# Altium schematic sheet GTY_Transceivers.SchDoc: RFSOC_AMC
size A2; Author: G.Kasprowicz; CompanyName: WUT ISE; DrawnBy: G.Kasprowicz; Organization: WUT ISE; Address1: PW ISE; Address2: Nowowiejska 15/19 00-665 Warsaw; Address3: gkasprow@gmail.com; DocumentNumber: 14; Revision: 2; SheetNumber: 15; SheetTotal: 54; ModifiedBy: -; CheckedDate: -; Title2: 8 channel ADC & DAC; DivGrp: WUT ISE; Designer: G.Kasprowicz; ModifiedDate: -; ProjectName: Sensor Box
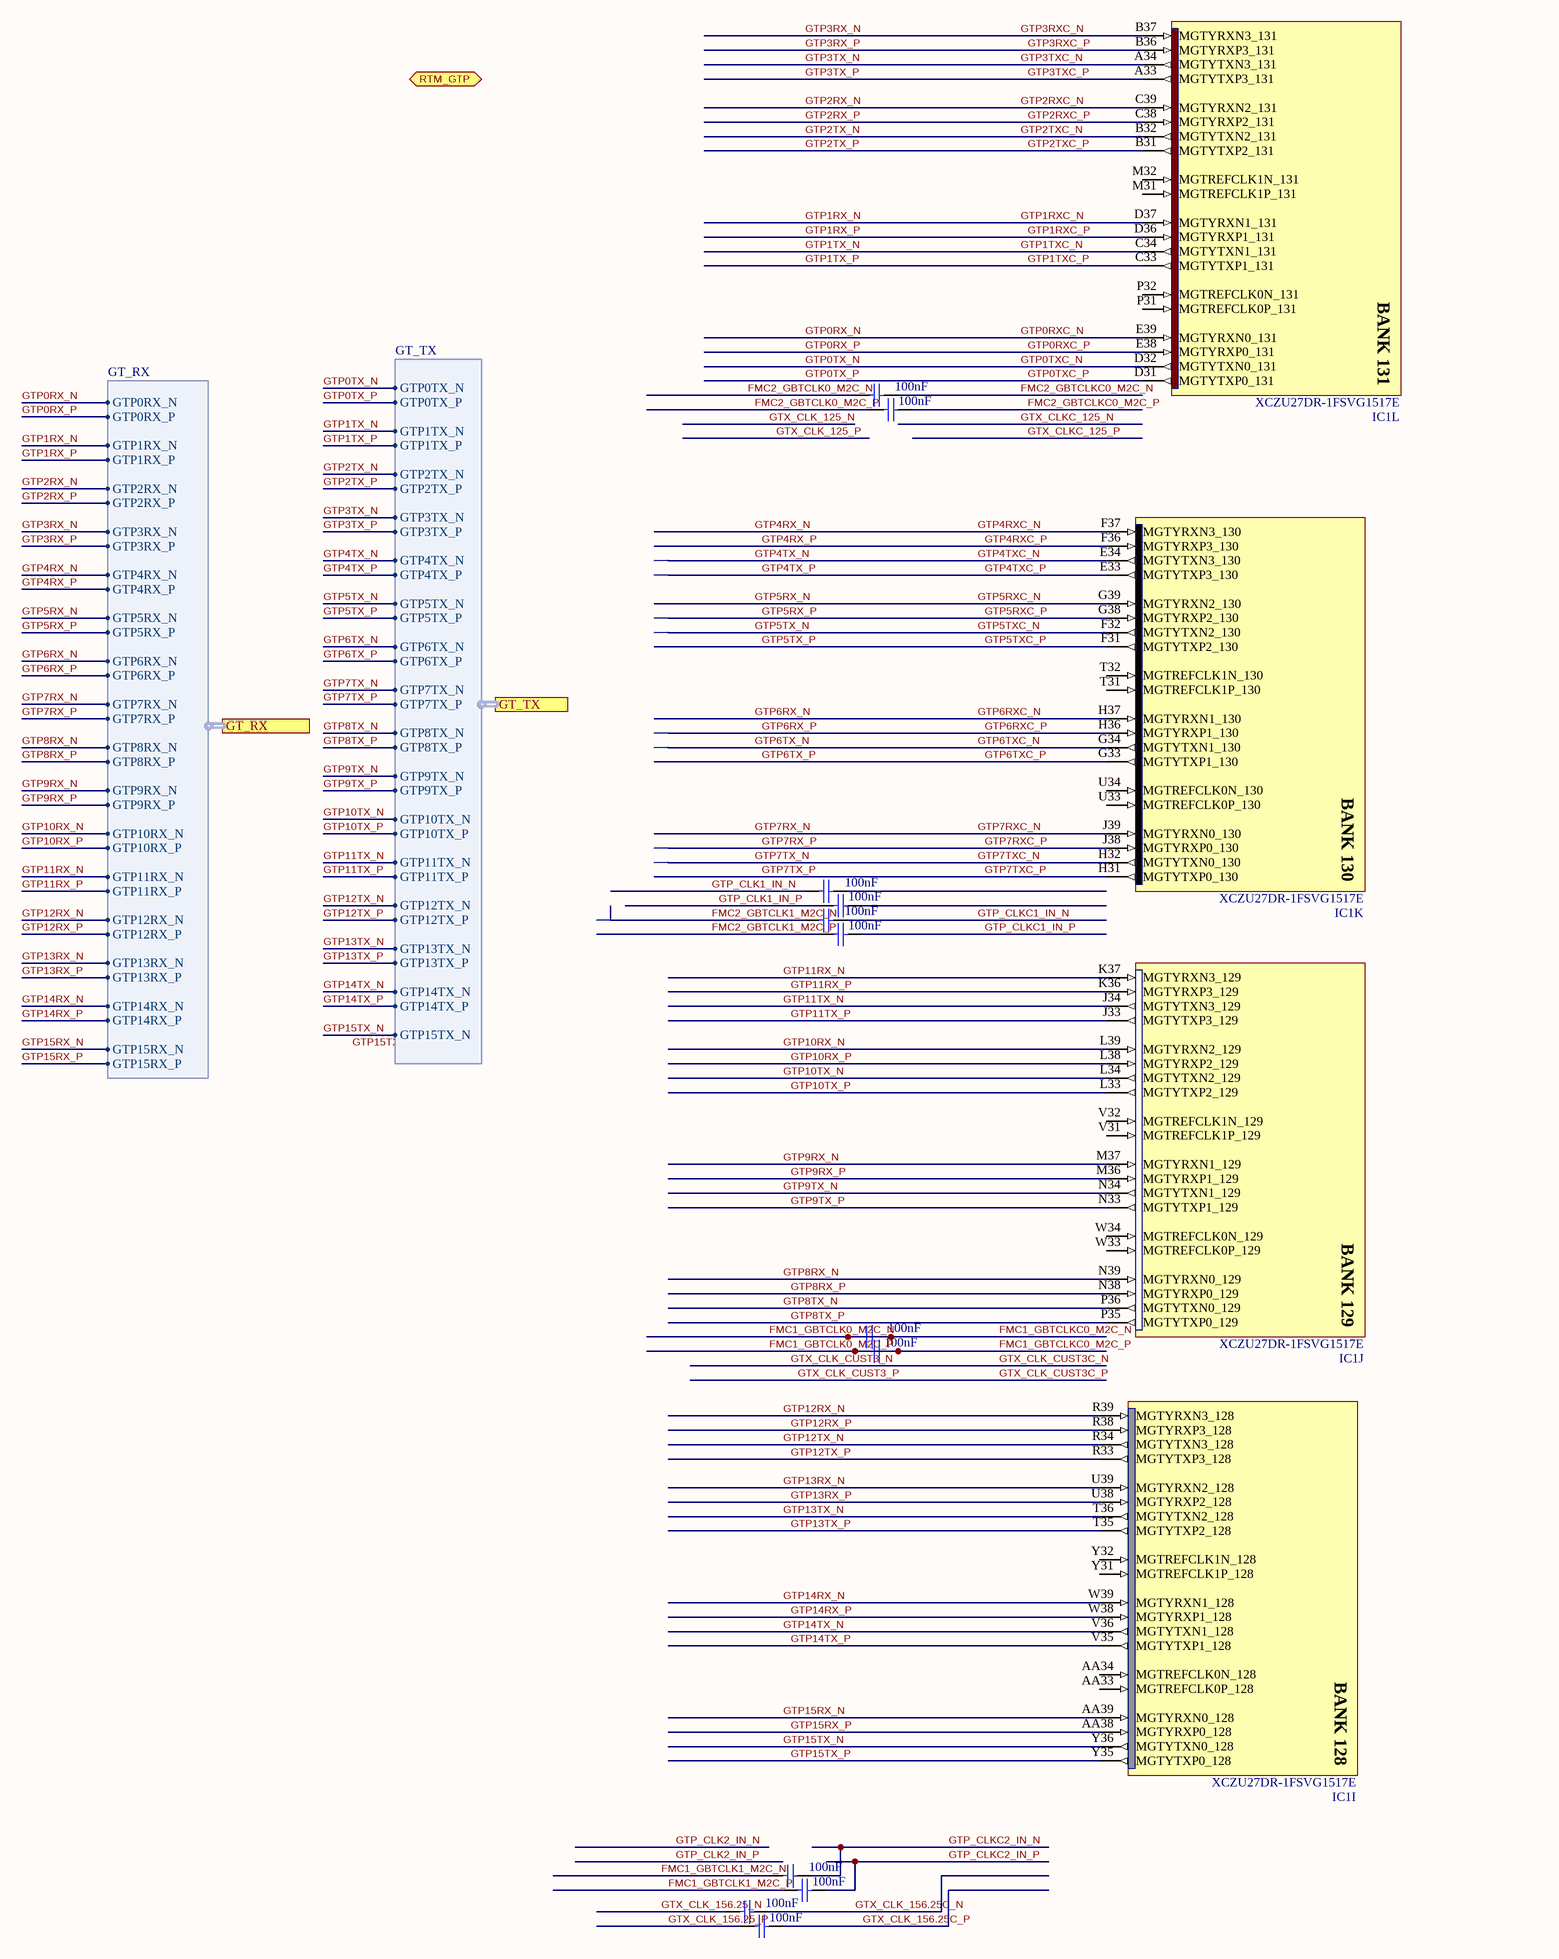
[diagram p0: GTY_Transceivers.SchDoc]

## Parts
C435  100nF
C436  100nF
C595  100nF
C596  100nF
C623  100nF
C624  100nF
C625  100nF
C626  100nF
C643  100nF
C644  100nF
C665  100nF
C666  100nF
IC1  XCZU27DR-1FSVG1517E  [XILINX_FSVG1517 (XCZU27DR)]  (parts I,J,K,L of 31)

## Ports
GT_RX (harness GT_RX), GT_TX (harness GT_TX), RTM_GTP (bidir)

## Harnesses
GT_RX: GTP0RX_N, GTP0RX_P, GTP1RX_N, GTP1RX_P, GTP2RX_N, GTP2RX_P, GTP3RX_N, GTP3RX_P, GTP4RX_P, GTP5RX_N, GTP4RX_N, GTP5RX_P, GTP6RX_N, GTP6RX_P, GTP7RX_N, GTP7RX_P, GTP8RX_N, GTP8RX_P, GTP9RX_N, GTP9RX_P, GTP10RX_N, GTP10RX_P, GTP11RX_N, GTP11RX_P, GTP12RX_N, GTP12RX_P, GTP13RX_N, GTP13RX_P, GTP14RX_N, GTP14RX_P, GTP15RX_N, GTP15RX_P
GT_TX: GTP0TX_N, GTP0TX_P, GTP1TX_N, GTP1TX_P, GTP2TX_N, GTP2TX_P, GTP3TX_N, GTP3TX_P, GTP4TX_N, GTP4TX_P, GTP5TX_N, GTP5TX_P, GTP6TX_N, GTP6TX_P, GTP7TX_N, GTP7TX_P, GTP8TX_N, GTP8TX_P, GTP9TX_N, GTP9TX_P, GTP10TX_N, GTP10TX_P, GTP11TX_N, GTP11TX_P, GTP12TX_N, GTP12TX_P, GTP13TX_N, GTP13TX_P, GTP14TX_N, GTP14TX_P, GTP15TX_N

## Nets
FMC1_GBTCLK0_M2C_N: C643.1 C643.2  [also labelled FMC1_GBTCLKC0_M2C_N]
FMC1_GBTCLK0_M2C_P: C644.1 C644.2  [also labelled FMC1_GBTCLKC0_M2C_P]
FMC1_GBTCLK1_M2C_N: C665.1
FMC1_GBTCLK1_M2C_P: C666.1
FMC2_GBTCLK0_M2C_N: C595.1
FMC2_GBTCLK0_M2C_P: C596.1
FMC2_GBTCLK1_M2C_N: C625.1
FMC2_GBTCLK1_M2C_P: C626.1
FMC2_GBTCLKC0_M2C_N: C595.2
FMC2_GBTCLKC0_M2C_P: C596.2
GTP0RX_N: IC1.E39(MGTYRXN0_131) ; port GT_RX.GTP0RX_N  [also labelled GTP0RXC_N]
GTP0RX_P: IC1.E38(MGTYRXP0_131) ; port GT_RX.GTP0RX_P  [also labelled GTP0RXC_P]
GTP0TX_N: IC1.D32(MGTYTXN0_131) ; port GT_TX.GTP0TX_N  [also labelled GTP0TXC_N]
GTP0TX_P: IC1.D31(MGTYTXP0_131) ; port GT_TX.GTP0TX_P  [also labelled GTP0TXC_P]
GTP1RX_N: IC1.D37(MGTYRXN1_131) ; port GT_RX.GTP1RX_N  [also labelled GTP1RXC_N]
GTP1RX_P: IC1.D36(MGTYRXP1_131) ; port GT_RX.GTP1RX_P  [also labelled GTP1RXC_P]
GTP1TX_N: IC1.C34(MGTYTXN1_131) ; port GT_TX.GTP1TX_N  [also labelled GTP1TXC_N]
GTP1TX_P: IC1.C33(MGTYTXP1_131) ; port GT_TX.GTP1TX_P  [also labelled GTP1TXC_P]
GTP2RX_N: IC1.C39(MGTYRXN2_131) ; port GT_RX.GTP2RX_N  [also labelled GTP2RXC_N]
GTP2RX_P: IC1.C38(MGTYRXP2_131) ; port GT_RX.GTP2RX_P  [also labelled GTP2RXC_P]
GTP2TX_N: IC1.B32(MGTYTXN2_131) ; port GT_TX.GTP2TX_N  [also labelled GTP2TXC_N]
GTP2TX_P: IC1.B31(MGTYTXP2_131) ; port GT_TX.GTP2TX_P  [also labelled GTP2TXC_P]
GTP3RX_N: IC1.B37(MGTYRXN3_131) ; port GT_RX.GTP3RX_N  [also labelled GTP3RXC_N]
GTP3RX_P: IC1.B36(MGTYRXP3_131) ; port GT_RX.GTP3RX_P  [also labelled GTP3RXC_P]
GTP3TX_N: IC1.A34(MGTYTXN3_131) ; port GT_TX.GTP3TX_N  [also labelled GTP3TXC_N]
GTP3TX_P: IC1.A33(MGTYTXP3_131) ; port GT_TX.GTP3TX_P  [also labelled GTP3TXC_P]
GTP4RX_N: IC1.F37(MGTYRXN3_130) ; port GT_RX.GTP4RX_N  [also labelled GTP4RXC_N]
GTP4RX_P: IC1.F36(MGTYRXP3_130) ; port GT_RX.GTP4RX_P  [also labelled GTP4RXC_P]
GTP4TX_N: IC1.E34(MGTYTXN3_130) ; port GT_TX.GTP4TX_N  [also labelled GTP4TXC_N]
GTP4TX_P: IC1.E33(MGTYTXP3_130) ; port GT_TX.GTP4TX_P  [also labelled GTP4TXC_P]
GTP5RX_N: IC1.G39(MGTYRXN2_130) ; port GT_RX.GTP5RX_N  [also labelled GTP5RXC_N]
GTP5RX_P: IC1.G38(MGTYRXP2_130) ; port GT_RX.GTP5RX_P  [also labelled GTP5RXC_P]
GTP5TX_N: IC1.F32(MGTYTXN2_130) ; port GT_TX.GTP5TX_N  [also labelled GTP5TXC_N]
GTP5TX_P: IC1.F31(MGTYTXP2_130) ; port GT_TX.GTP5TX_P  [also labelled GTP5TXC_P]
GTP6RX_N: IC1.H37(MGTYRXN1_130) ; port GT_RX.GTP6RX_N  [also labelled GTP6RXC_N]
GTP6RX_P: IC1.H36(MGTYRXP1_130) ; port GT_RX.GTP6RX_P  [also labelled GTP6RXC_P]
GTP6TX_N: IC1.G34(MGTYTXN1_130) ; port GT_TX.GTP6TX_N  [also labelled GTP6TXC_N]
GTP6TX_P: IC1.G33(MGTYTXP1_130) ; port GT_TX.GTP6TX_P  [also labelled GTP6TXC_P]
GTP7RX_N: IC1.J39(MGTYRXN0_130) ; port GT_RX.GTP7RX_N  [also labelled GTP7RXC_N]
GTP7RX_P: IC1.J38(MGTYRXP0_130) ; port GT_RX.GTP7RX_P  [also labelled GTP7RXC_P]
GTP7TX_N: IC1.H32(MGTYTXN0_130) ; port GT_TX.GTP7TX_N  [also labelled GTP7TXC_N]
GTP7TX_P: IC1.H31(MGTYTXP0_130) ; port GT_TX.GTP7TX_P  [also labelled GTP7TXC_P]
GTP8RX_N: IC1.N39(MGTYRXN0_129) ; port GT_RX.GTP8RX_N
GTP8RX_P: IC1.N38(MGTYRXP0_129) ; port GT_RX.GTP8RX_P
GTP8TX_N: IC1.P36(MGTYTXN0_129) ; port GT_TX.GTP8TX_N
GTP8TX_P: IC1.P35(MGTYTXP0_129) ; port GT_TX.GTP8TX_P
GTP9RX_N: IC1.M37(MGTYRXN1_129) ; port GT_RX.GTP9RX_N
GTP9RX_P: IC1.M36(MGTYRXP1_129) ; port GT_RX.GTP9RX_P
GTP9TX_N: IC1.N34(MGTYTXN1_129) ; port GT_TX.GTP9TX_N
GTP9TX_P: IC1.N33(MGTYTXP1_129) ; port GT_TX.GTP9TX_P
GTP10RX_N: IC1.L39(MGTYRXN2_129) ; port GT_RX.GTP10RX_N
GTP10RX_P: IC1.L38(MGTYRXP2_129) ; port GT_RX.GTP10RX_P
GTP10TX_N: IC1.L34(MGTYTXN2_129) ; port GT_TX.GTP10TX_N
GTP10TX_P: IC1.L33(MGTYTXP2_129) ; port GT_TX.GTP10TX_P
GTP11RX_N: IC1.K37(MGTYRXN3_129) ; port GT_RX.GTP11RX_N
GTP11RX_P: IC1.K36(MGTYRXP3_129) ; port GT_RX.GTP11RX_P
GTP11TX_N: IC1.J34(MGTYTXN3_129) ; port GT_TX.GTP11TX_N
GTP11TX_P: IC1.J33(MGTYTXP3_129) ; port GT_TX.GTP11TX_P
GTP12RX_N: IC1.R39(MGTYRXN3_128) ; port GT_RX.GTP12RX_N
GTP12RX_P: IC1.R38(MGTYRXP3_128) ; port GT_RX.GTP12RX_P
GTP12TX_N: IC1.R34(MGTYTXN3_128) ; port GT_TX.GTP12TX_N
GTP12TX_P: IC1.R33(MGTYTXP3_128) ; port GT_TX.GTP12TX_P
GTP13RX_N: IC1.U39(MGTYRXN2_128) ; port GT_RX.GTP13RX_N
GTP13RX_P: IC1.U38(MGTYRXP2_128) ; port GT_RX.GTP13RX_P
GTP13TX_N: IC1.T36(MGTYTXN2_128) ; port GT_TX.GTP13TX_N
GTP13TX_P: IC1.T35(MGTYTXP2_128) ; port GT_TX.GTP13TX_P
GTP14RX_N: IC1.W39(MGTYRXN1_128) ; port GT_RX.GTP14RX_N
GTP14RX_P: IC1.W38(MGTYRXP1_128) ; port GT_RX.GTP14RX_P
GTP14TX_N: IC1.V36(MGTYTXN1_128) ; port GT_TX.GTP14TX_N
GTP14TX_P: IC1.V35(MGTYTXP1_128) ; port GT_TX.GTP14TX_P
GTP15RX_N: IC1.AA39(MGTYRXN0_128) ; port GT_RX.GTP15RX_N
GTP15RX_P: IC1.AA38(MGTYRXP0_128) ; port GT_RX.GTP15RX_P
GTP15TX_N: IC1.Y36(MGTYTXN0_128) ; port GT_TX.GTP15TX_N
GTP15TX_P: IC1.Y35(MGTYTXP0_128)
GTP_CLK1_IN_N: C623.1
GTP_CLK1_IN_P: C624.1
GTP_CLKC1_IN_N: C625.2
GTP_CLKC1_IN_P: C626.2
GTP_CLKC2_IN_N: C665.2
GTP_CLKC2_IN_P: C666.2
GTX_CLK_156.25_N: C435.1
GTX_CLK_156.25_P: C436.1
GTX_CLK_156.25C_N: C435.2
GTX_CLK_156.25C_P: C436.2

Not connected (* = marked no-connect by the designer): C623 2; C624 2; IC1 AA33(MGTREFCLK0P_128) AA34(MGTREFCLK0N_128) M31(MGTREFCLK1P_131) M32(MGTREFCLK1N_131) P31(MGTREFCLK0P_131) P32(MGTREFCLK0N_131) T31(MGTREFCLK1P_130) T32(MGTREFCLK1N_130) U33(MGTREFCLK0P_130) U34(MGTREFCLK0N_130) V31(MGTREFCLK1P_129) V32(MGTREFCLK1N_129) W33(MGTREFCLK0P_129) W34(MGTREFCLK0N_129) Y31(MGTREFCLK1P_128) Y32(MGTREFCLK1N_128)

## Notes on the sheet
- Labels drawn without touching a wire or pin: GTP15TX_P
- Title
- Size:
- Date:
- File:
- A2
- Number:
- Time:
- Revision:
- Sheet
- of
- (in symbol XCZU27DR-1FSVG1517E, part I) BANK 128
- (in symbol XCZU27DR-1FSVG1517E, part J) BANK 129
- (in symbol XCZU27DR-1FSVG1517E, part K) BANK 130
- (in symbol XCZU27DR-1FSVG1517E, part L) BANK 131

## Library data of the parts
C435 = (no symbol name): $$NotCommonProperty_General Part Number: CC0201_100NF_6.3V_10%_X5R; $$NotCommonProperty_Manufacturer1 Example: AVX; $$NotCommonProperty_Manufacturer1 Part Number: 02016D104KAT2A; Manufacturer: GENERIC; Part Description: SMD Multilayer Chip Ceramic Capacitor; Part Name: Capacitor - non polarized CAPC0603X33N; $$Internal_Resolution: 00001mm; $$NotCommonProperty_Case: 0201; $$NotCommonProperty_Pin Count: 2; $$NotCommonProperty_SMD: Yes; $$NotCommonProperty_Status: Not Recommended; $$NotCommonProperty_TC: X5R; $$NotCommonProperty_Voltage: 6.3V; Cell Name: CAPC0603X33N; CmpIndex: 948; DXDB_LIBNAME: Capacitors SMD; Ref Designator: C737; SymIndex: 331; Tolerance: ±10%; Footprint: CAPC0603X33N; Manufacturer Part Number: CC0201_100NF_6.3V_10%_X5R; Part Number: Capacitor - non polarized CAPC0603X33N; Value: 100nF; Orientation: 0 = 0
C436 = (no symbol name): $$NotCommonProperty_General Part Number: CC0201_100NF_6.3V_10%_X5R; $$NotCommonProperty_Manufacturer1 Example: AVX; $$NotCommonProperty_Manufacturer1 Part Number: 02016D104KAT2A; Manufacturer: GENERIC; Part Description: SMD Multilayer Chip Ceramic Capacitor; Part Name: Capacitor - non polarized CAPC0603X33N; $$Internal_Resolution: 00001mm; $$NotCommonProperty_Case: 0201; $$NotCommonProperty_Pin Count: 2; $$NotCommonProperty_SMD: Yes; $$NotCommonProperty_Status: Not Recommended; $$NotCommonProperty_TC: X5R; $$NotCommonProperty_Voltage: 6.3V; Cell Name: CAPC0603X33N; CmpIndex: 947; DXDB_LIBNAME: Capacitors SMD; Ref Designator: C738; SymIndex: 331; Tolerance: ±10%; Footprint: CAPC0603X33N; Manufacturer Part Number: CC0201_100NF_6.3V_10%_X5R; Part Number: Capacitor - non polarized CAPC0603X33N; Value: 100nF; Orientation: 0 = 0
C595 = (no symbol name): $$NotCommonProperty_General Part Number: CC0201_100NF_6.3V_10%_X5R; $$NotCommonProperty_Manufacturer1 Example: AVX; $$NotCommonProperty_Manufacturer1 Part Number: 02016D104KAT2A; Manufacturer: GENERIC; Part Description: SMD Multilayer Chip Ceramic Capacitor; Part Name: Capacitor - non polarized CAPC0603X33N; $$Internal_Resolution: 00001mm; $$NotCommonProperty_Case: 0201; $$NotCommonProperty_Pin Count: 2; $$NotCommonProperty_SMD: Yes; $$NotCommonProperty_Status: Not Recommended; $$NotCommonProperty_TC: X5R; $$NotCommonProperty_Voltage: 6.3V; Cell Name: CAPC0603X33N; CmpIndex: 776; DXDB_LIBNAME: Capacitors SMD; Ref Designator: C595; SymIndex: 331; Tolerance: ±10%; Footprint: CAPC0603X33N; Manufacturer Part Number: CC0201_100NF_6.3V_10%_X5R; Part Number: Capacitor - non polarized CAPC0603X33N; Value: 100nF; Orientation: 0 = 0
C596 = (no symbol name): $$NotCommonProperty_General Part Number: CC0201_100NF_6.3V_10%_X5R; $$NotCommonProperty_Manufacturer1 Example: AVX; $$NotCommonProperty_Manufacturer1 Part Number: 02016D104KAT2A; Manufacturer: GENERIC; Part Description: SMD Multilayer Chip Ceramic Capacitor; Part Name: Capacitor - non polarized CAPC0603X33N; $$Internal_Resolution: 00001mm; $$NotCommonProperty_Case: 0201; $$NotCommonProperty_Pin Count: 2; $$NotCommonProperty_SMD: Yes; $$NotCommonProperty_Status: Not Recommended; $$NotCommonProperty_TC: X5R; $$NotCommonProperty_Voltage: 6.3V; Cell Name: CAPC0603X33N; CmpIndex: 775; DXDB_LIBNAME: Capacitors SMD; Ref Designator: C596; SymIndex: 331; Tolerance: ±10%; Footprint: CAPC0603X33N; Manufacturer Part Number: CC0201_100NF_6.3V_10%_X5R; Part Number: Capacitor - non polarized CAPC0603X33N; Value: 100nF; Orientation: 0 = 0
C623 = (no symbol name): $$NotCommonProperty_General Part Number: CC0201_100NF_6.3V_10%_X5R; $$NotCommonProperty_Manufacturer1 Example: AVX; $$NotCommonProperty_Manufacturer1 Part Number: 02016D104KAT2A; Manufacturer: GENERIC; Part Description: SMD Multilayer Chip Ceramic Capacitor; Part Name: Capacitor - non polarized CAPC0603X33N; $$Internal_Resolution: 00001mm; $$NotCommonProperty_Case: 0201; $$NotCommonProperty_Pin Count: 2; $$NotCommonProperty_SMD: Yes; $$NotCommonProperty_Status: Not Recommended; $$NotCommonProperty_TC: X5R; $$NotCommonProperty_Voltage: 6.3V; Cell Name: CAPC0603X33N; CmpIndex: 789; DXDB_LIBNAME: Capacitors SMD; Ref Designator: C623; SymIndex: 331; Tolerance: ±10%; Footprint: CAPC0603X33N; Manufacturer Part Number: CC0201_100NF_6.3V_10%_X5R; Part Number: Capacitor - non polarized CAPC0603X33N; Value: 100nF; Orientation: 0 = 0
C624 = (no symbol name): $$NotCommonProperty_General Part Number: CC0201_100NF_6.3V_10%_X5R; $$NotCommonProperty_Manufacturer1 Example: AVX; $$NotCommonProperty_Manufacturer1 Part Number: 02016D104KAT2A; Manufacturer: GENERIC; Part Description: SMD Multilayer Chip Ceramic Capacitor; Part Name: Capacitor - non polarized CAPC0603X33N; $$Internal_Resolution: 00001mm; $$NotCommonProperty_Case: 0201; $$NotCommonProperty_Pin Count: 2; $$NotCommonProperty_SMD: Yes; $$NotCommonProperty_Status: Not Recommended; $$NotCommonProperty_TC: X5R; $$NotCommonProperty_Voltage: 6.3V; Cell Name: CAPC0603X33N; CmpIndex: 790; DXDB_LIBNAME: Capacitors SMD; Ref Designator: C624; SymIndex: 331; Tolerance: ±10%; Footprint: CAPC0603X33N; Manufacturer Part Number: CC0201_100NF_6.3V_10%_X5R; Part Number: Capacitor - non polarized CAPC0603X33N; Value: 100nF; Orientation: 0 = 0
C625 = (no symbol name): $$NotCommonProperty_General Part Number: CC0201_100NF_6.3V_10%_X5R; $$NotCommonProperty_Manufacturer1 Example: AVX; $$NotCommonProperty_Manufacturer1 Part Number: 02016D104KAT2A; Manufacturer: GENERIC; Part Description: SMD Multilayer Chip Ceramic Capacitor; Part Name: Capacitor - non polarized CAPC0603X33N; $$Internal_Resolution: 00001mm; $$NotCommonProperty_Case: 0201; $$NotCommonProperty_Pin Count: 2; $$NotCommonProperty_SMD: Yes; $$NotCommonProperty_Status: Not Recommended; $$NotCommonProperty_TC: X5R; $$NotCommonProperty_Voltage: 6.3V; Cell Name: CAPC0603X33N; CmpIndex: 791; DXDB_LIBNAME: Capacitors SMD; Ref Designator: C625; SymIndex: 331; Tolerance: ±10%; Footprint: CAPC0603X33N; Manufacturer Part Number: CC0201_100NF_6.3V_10%_X5R; Part Number: Capacitor - non polarized CAPC0603X33N; Value: 100nF; Orientation: 0 = 0
C626 = (no symbol name): $$NotCommonProperty_General Part Number: CC0201_100NF_6.3V_10%_X5R; $$NotCommonProperty_Manufacturer1 Example: AVX; $$NotCommonProperty_Manufacturer1 Part Number: 02016D104KAT2A; Manufacturer: GENERIC; Part Description: SMD Multilayer Chip Ceramic Capacitor; Part Name: Capacitor - non polarized CAPC0603X33N; $$Internal_Resolution: 00001mm; $$NotCommonProperty_Case: 0201; $$NotCommonProperty_Pin Count: 2; $$NotCommonProperty_SMD: Yes; $$NotCommonProperty_Status: Not Recommended; $$NotCommonProperty_TC: X5R; $$NotCommonProperty_Voltage: 6.3V; Cell Name: CAPC0603X33N; CmpIndex: 792; DXDB_LIBNAME: Capacitors SMD; Ref Designator: C626; SymIndex: 331; Tolerance: ±10%; Footprint: CAPC0603X33N; Manufacturer Part Number: CC0201_100NF_6.3V_10%_X5R; Part Number: Capacitor - non polarized CAPC0603X33N; Value: 100nF; Orientation: 0 = 0
C643 = (no symbol name): $$NotCommonProperty_General Part Number: CC0201_100NF_6.3V_10%_X5R; $$NotCommonProperty_Manufacturer1 Example: AVX; $$NotCommonProperty_Manufacturer1 Part Number: 02016D104KAT2A; Manufacturer: GENERIC; Part Description: SMD Multilayer Chip Ceramic Capacitor; Part Name: Capacitor - non polarized CAPC0603X33N; $$Internal_Resolution: 00001mm; $$NotCommonProperty_Case: 0201; $$NotCommonProperty_Pin Count: 2; $$NotCommonProperty_SMD: Yes; $$NotCommonProperty_Status: Not Recommended; $$NotCommonProperty_TC: X5R; $$NotCommonProperty_Voltage: 6.3V; Cell Name: CAPC0603X33N; CmpIndex: 823; DXDB_LIBNAME: Capacitors SMD; Ref Designator: C643; SymIndex: 331; Tolerance: ±10%; Footprint: CAPC0603X33N; Manufacturer Part Number: CC0201_100NF_6.3V_10%_X5R; Part Number: Capacitor - non polarized CAPC0603X33N; Value: 100nF; Orientation: 0 = 0
C644 = (no symbol name): $$NotCommonProperty_General Part Number: CC0201_100NF_6.3V_10%_X5R; $$NotCommonProperty_Manufacturer1 Example: AVX; $$NotCommonProperty_Manufacturer1 Part Number: 02016D104KAT2A; Manufacturer: GENERIC; Part Description: SMD Multilayer Chip Ceramic Capacitor; Part Name: Capacitor - non polarized CAPC0603X33N; $$Internal_Resolution: 00001mm; $$NotCommonProperty_Case: 0201; $$NotCommonProperty_Pin Count: 2; $$NotCommonProperty_SMD: Yes; $$NotCommonProperty_Status: Not Recommended; $$NotCommonProperty_TC: X5R; $$NotCommonProperty_Voltage: 6.3V; Cell Name: CAPC0603X33N; CmpIndex: 824; DXDB_LIBNAME: Capacitors SMD; Ref Designator: C644; SymIndex: 331; Tolerance: ±10%; Footprint: CAPC0603X33N; Manufacturer Part Number: CC0201_100NF_6.3V_10%_X5R; Part Number: Capacitor - non polarized CAPC0603X33N; Value: 100nF; Orientation: 0 = 0
C665 = (no symbol name): $$NotCommonProperty_General Part Number: CC0201_100NF_6.3V_10%_X5R; $$NotCommonProperty_Manufacturer1 Example: AVX; $$NotCommonProperty_Manufacturer1 Part Number: 02016D104KAT2A; Manufacturer: GENERIC; Part Description: SMD Multilayer Chip Ceramic Capacitor; Part Name: Capacitor - non polarized CAPC0603X33N; $$Internal_Resolution: 00001mm; $$NotCommonProperty_Case: 0201; $$NotCommonProperty_Pin Count: 2; $$NotCommonProperty_SMD: Yes; $$NotCommonProperty_Status: Not Recommended; $$NotCommonProperty_TC: X5R; $$NotCommonProperty_Voltage: 6.3V; Cell Name: CAPC0603X33N; CmpIndex: 845; DXDB_LIBNAME: Capacitors SMD; Ref Designator: C665; SymIndex: 331; Tolerance: ±10%; Footprint: CAPC0603X33N; Manufacturer Part Number: CC0201_100NF_6.3V_10%_X5R; Part Number: Capacitor - non polarized CAPC0603X33N; Value: 100nF; Orientation: 0 = 0
C666 = (no symbol name): $$NotCommonProperty_General Part Number: CC0201_100NF_6.3V_10%_X5R; $$NotCommonProperty_Manufacturer1 Example: AVX; $$NotCommonProperty_Manufacturer1 Part Number: 02016D104KAT2A; Manufacturer: GENERIC; Part Description: SMD Multilayer Chip Ceramic Capacitor; Part Name: Capacitor - non polarized CAPC0603X33N; $$Internal_Resolution: 00001mm; $$NotCommonProperty_Case: 0201; $$NotCommonProperty_Pin Count: 2; $$NotCommonProperty_SMD: Yes; $$NotCommonProperty_Status: Not Recommended; $$NotCommonProperty_TC: X5R; $$NotCommonProperty_Voltage: 6.3V; Cell Name: CAPC0603X33N; CmpIndex: 846; DXDB_LIBNAME: Capacitors SMD; Ref Designator: C666; SymIndex: 331; Tolerance: ±10%; Footprint: CAPC0603X33N; Manufacturer Part Number: CC0201_100NF_6.3V_10%_X5R; Part Number: Capacitor - non polarized CAPC0603X33N; Value: 100nF; Orientation: 0 = 0
IC1 = XCZU27DR-1FSVG1517E: Zynq UltraScale+ RFSoC, Quad-Core ARM® Cortex™-A53 MPCore™ up to 1.5GHz, 214 PS I/O, 299 HP I/O, 48 HD I/O, 1517-Pin BGA; Manufacturer: XILINX; PressFit: No; Bonding: No; Part Number: XCZU27DR-1FSVG1517E; Component Kind: Standard; Component Type: Standard; Device: XCZU27DR-1FSVG1517E; PackageDescription: BGA, 1.00mm Pitch, Square; 1517 Pin, 39 Columns X 39 Rows, 40.00mm X 40.00mm X 4.01mm H; Part Description: Zynq UltraScale+ RFSoC, Quad-Core ARM® Cortex™-A53 MPCore™ up to 1.5GHz, 214 PS I/O, 299 HP I/O, 48 HD I/O, 1517-Pin BGA; Manufacturer Part Number: XCZU27DR-1FSVG1517E; Pin Count: 1517; Case: BGA1517; Mounted: Yes; Socket: No; SMD: Yes; Sense: No; ComponentHeight: 4.01mm; HelpURL: \\cern.ch\dfs\Applications\Altium\Datasheets\XCZU27DR-1FSVG1517E.pdf; ComponentLink1URL: \\cern.ch\dfs\Applications\Altium\Datasheets\XCZU27DR-1FSVG1517E_Package-Pinout.pdf; ComponentLink1Description: Package/Pinout; ComponentLink2URL: \\cern.ch\dfs\Applications\Altium\Datasheets\XCZU27DR-1FSVG1517E_Pinout.pdf; ComponentLink2Description: Pinout; Author: CERN DEM MR; CreateDate: 02/05/2018; LatestRevisionDate: 02/05/2018